# Altium schematic sheet 2HBM2_Pwr.SchDoc
size A3; SheetNumber: 11; SheetTotal: 13
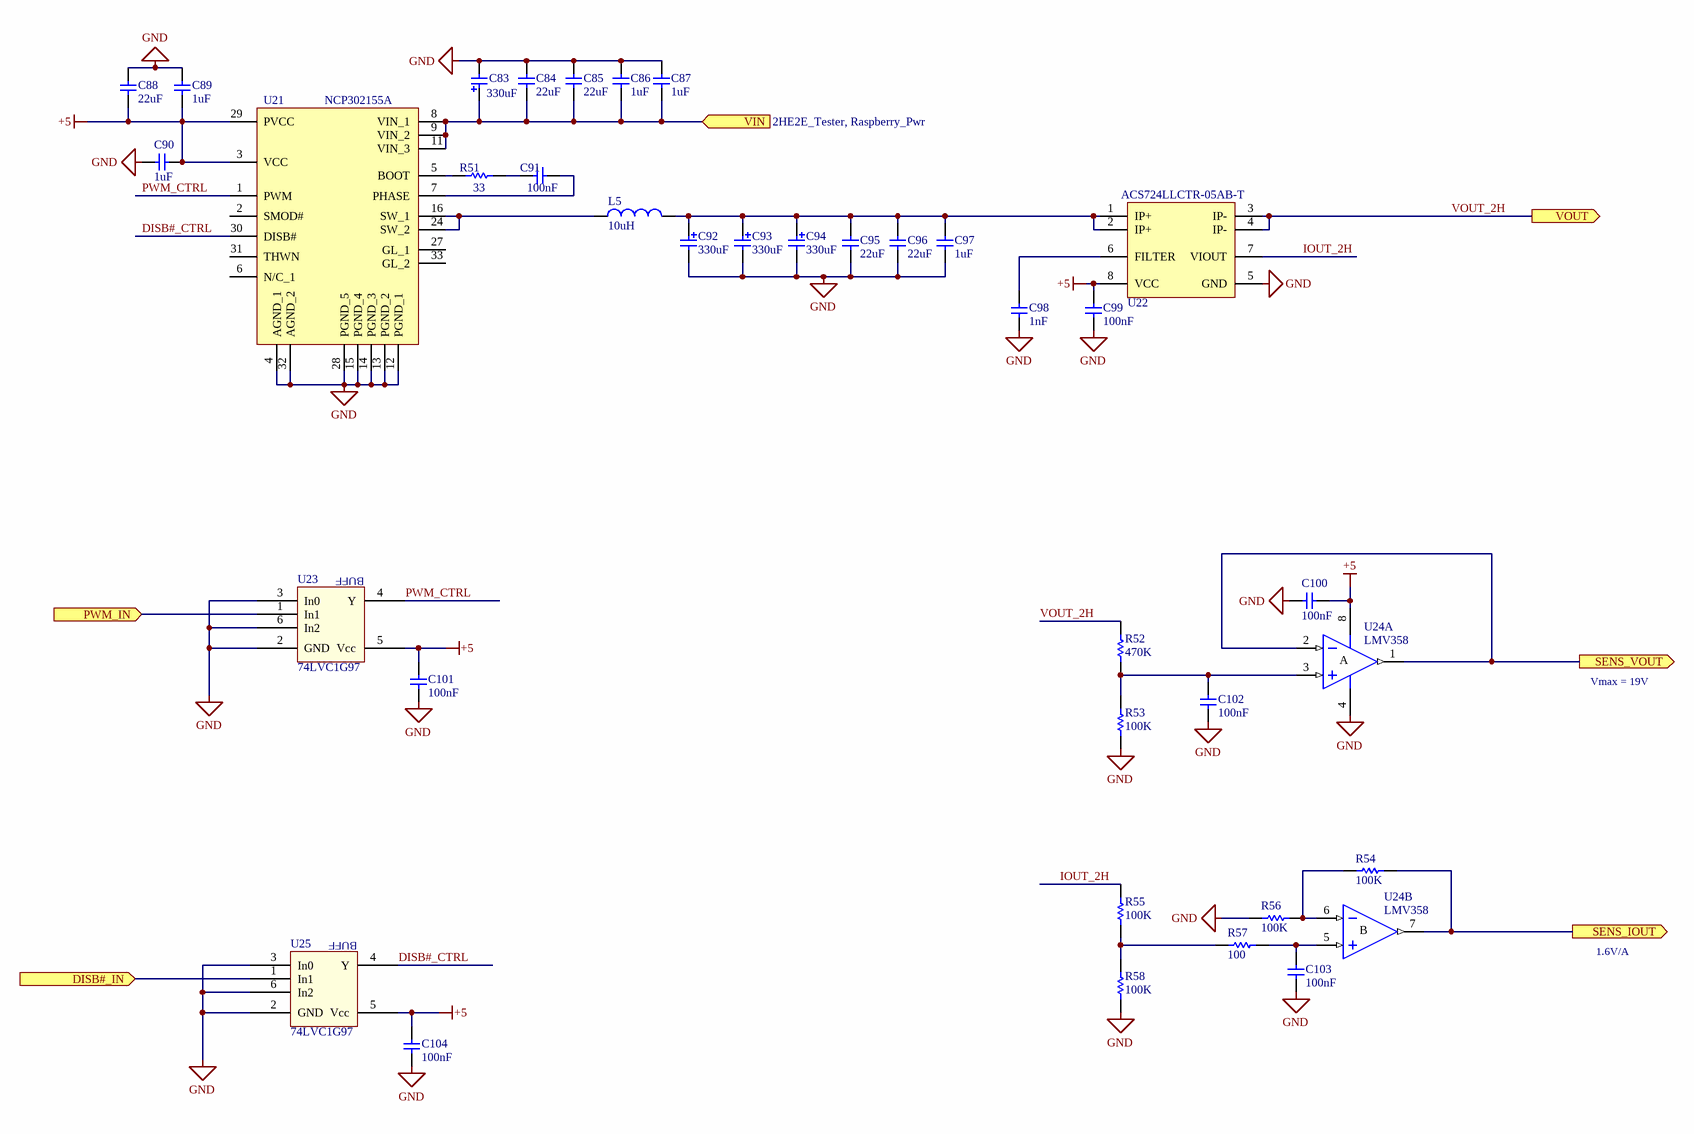
[diagram p0: 2HBM2_Pwr.SchDoc]

## Parts
C83  value 330uF  [Cap Elet SMD 8.0 mm CASE E-h6.5mm]  (hidden comment: Cap Elettrolitico)
C84  value 22uF  [1206M]  (hidden comment: Cap Ceramic)
C85  value 22uF  [1206M]  (hidden comment: Cap Ceramic)
C86  value 1uF  [1206M]  (hidden comment: Cap Ceramic)
C87  value 1uF  [1206M]  (hidden comment: Cap Ceramic)
C88  value 22uF  [1206M]  (hidden comment: Cap Ceramic)
C89  value 1uF  [1206M]  (hidden comment: Cap Ceramic)
C90  value 1uF  [1206M]  (hidden comment: Cap Ceramic)
C91  value 100nF  [0603M-C]  (hidden comment: Cap Ceramic)
C92  value 330uF  [Cap Elet SMD 8.0 mm CASE E-h6.5mm]  (hidden comment: Cap Elettrolitico)
C93  value 330uF  [Cap Elet SMD 8.0 mm CASE E-h6.5mm]  (hidden comment: Cap Elettrolitico)
C94  value 330uF  [Cap Elet SMD 8.0 mm CASE E-h6.5mm]  (hidden comment: Cap Elettrolitico)
C95  value 22uF  [1206M]  (hidden comment: Cap Ceramic)
C96  value 22uF  [1206M]  (hidden comment: Cap Ceramic)
C97  value 1uF  [1206M]  (hidden comment: Cap Ceramic)
C98  value 1nF  [0603M]  (hidden comment: Cap Ceramic)
C99  value 100nF  [0603M]  (hidden comment: Cap Ceramic)
C100  value 100nF  [0603M]  (hidden comment: Cap Ceramic)
C101  value 100nF  [0603M]  (hidden comment: Cap Ceramic)
C102  value 100nF  [0603M]  (hidden comment: Cap Ceramic)
C103  value 100nF  [0603M]  (hidden comment: Cap Ceramic)
C104  value 100nF  [0603M]  (hidden comment: Cap Ceramic)
L5  value 10uH  [WE-HCC_1210]  (hidden comment: Induttanza)
R51  value 33  [0603M]  (hidden comment: Resistor)
R52  value 470K  [0603M]  (hidden comment: Resistor)
R53  value 100K  [0603M]  (hidden comment: Resistor)
R54  value 100K  [0603M]  (hidden comment: Resistor)
R55  value 100K  [0603M]  (hidden comment: Resistor)
R56  value 100K  [0603M]  (hidden comment: Resistor)
R57  value 100  [0603M]  (hidden comment: Resistor)
R58  value 100K  [0603M]  (hidden comment: Resistor)
U21  NCP302155A  [NCP302155A]
U22  ACS724LLCTR-05AB-T  [SOIC127P600-8N]
U23  74LVC1G97  [TSOP65P211-6N]
U24  LMV358  [SOIC127P600-8N]  (parts A,B of 2)
U25  74LVC1G97  [TSOP65P211-6N]

## Ports
DISB#_IN (in, see 2HE2E_Tester), PWM_IN (in, see 2HE2E_Tester), SENS_IOUT (out, see 2HE2E_Tester), SENS_VOUT (out, see 2HE2E_Tester), VIN (in, see 2HE2E_Tester, Raspberry_Pwr), VOUT (out, see 2HE2E_Tester)

## Nets
+5: C88.2 C89.1 C90.1 C99.2 C100.2 C101.2 C104.2 U21.3(VCC) U21.29(PVCC) U22.8(VCC) U23.5(Vcc) U24.8(V+) U25.5(Vcc)
GND: C83.2 C84.2 C85.2 C86.2 C87.2 C88.1 C89.2 C90.2 C92.2 C93.2 C94.2 C95.2 C96.2 C97.2 C98.1 C99.1 C100.1 C101.1 C102.1 C103.1 C104.1 R53.1 R56.2 R58.2 U21.4(AGND_1) U21.12(PGND_1) U21.13(PGND_2) U21.14(PGND_3) U21.15(PGND_4) U21.28(PGND_5) U21.32(AGND_2) U22.5(GND) U23.2(GND) U23.3(In0) U23.6(In2) U24.4(GND) U25.2(GND) U25.3(In0) U25.6(In2)
DISB#_CTRL: U21.30(DISB#) U25.4(Y)
DISB#_IN: U25.1(In1) ; port DISB#_IN
IOUT_2H: R55.1 U22.7(VIOUT)
PWM_CTRL: U21.1(PWM) U23.4(Y)
PWM_IN: U23.1(In1) ; port PWM_IN
SENS_IOUT: R54.1 U24.7(OUT) ; port SENS_IOUT
SENS_VOUT: U24.1(OUT) U24.2(IN-) ; port SENS_VOUT
VIN: C83.1 C84.1 C85.1 C86.1 C87.1 U21.8(VIN_1) U21.9(VIN_2) U21.11(VIN_3) ; port VIN
VOUT_2H: R52.2 U22.3(IP-) U22.4(IP-) ; port VOUT
NetC91_1: C91.1 R51.2
NetC91_2: C91.2 U21.7(PHASE)
NetC92_1: C92.1 C93.1 C94.1 C95.1 C96.1 C97.1 L5.2 U22.1(IP+) U22.2(IP+)
NetC98_2: C98.2 U22.6(FILTER)
NetC102_2: C102.2 R52.1 R53.2 U24.3(IN+)
NetC103_2: C103.2 R57.1 U24.5(IN+)
NetL5_1: L5.1 U21.16(SW_1) U21.24(SW_2)
NetR51_1: R51.1 U21.5(BOOT)
NetR54_2: R54.2 R56.1 U24.6(IN-)
NetR55_2: R55.2 R57.2 R58.1

Not connected (* = marked no-connect by the designer): U21 2(SMOD#) 6(N/C_1) 27(GL_1) 31(THWN) 33(GL_2)

## Notes on the sheet
- (near U23) BUFF
- Vmax = 19V
- (near U25) BUFF
- 1.6V/A
- Title
- Size:
- Date:
- A4
- Number:
- Time:
- Revision:
- Sheet
- of
- File:
- (in symbol LMV358, part A) A
- (in symbol LMV358, part B) B

## Library data of the parts
C83 C92-C94 = Cap Elettrolitico: Condensatore elettrolitico 35V D8
C84 C85 C88 C95 C96 C98-C104 = Cap Ceramic: Ceramic Capacitor 25V
C86 C87 C89 C90 C97 = Cap Ceramic: Ceramic Capacitor 50V
C91 = Cap Ceramic: Ceramic Capacitor
L5 = Induttanza: WE 7443321000
U21 = NCP302155A: Integrated Driver and MOSFET
U22 = ACS724LLCTR-xxxx: Automotive-Grade, Galvanically Isolated Current Sensor IC with Common-Mode Field Rejection
U23 U25 = 74LVC1G97: Logic gate configurabile
U24 = LMV358: Dual Operational Amplifier Single Supply Rail to Rail; DatasheetDocument: Jan-1999; PackageDocument: Jul-1998; Publisher: Altium Limited; Code_JEDEC: MS-012-AA; Code_IPC: SO8; ComponentLink1Description: Manufacturer Link; ComponentLink1URL: http://www.st.com/; ComponentLink2Description: Datasheet; ComponentLink2URL: http://www.st.com/stonline/products/literature/ds/2300/tl082.pdf